# Altium schematic sheet 04-multimodal-flash.SchDoc
size A4; SheetNumber: 2; SheetTotal: 11
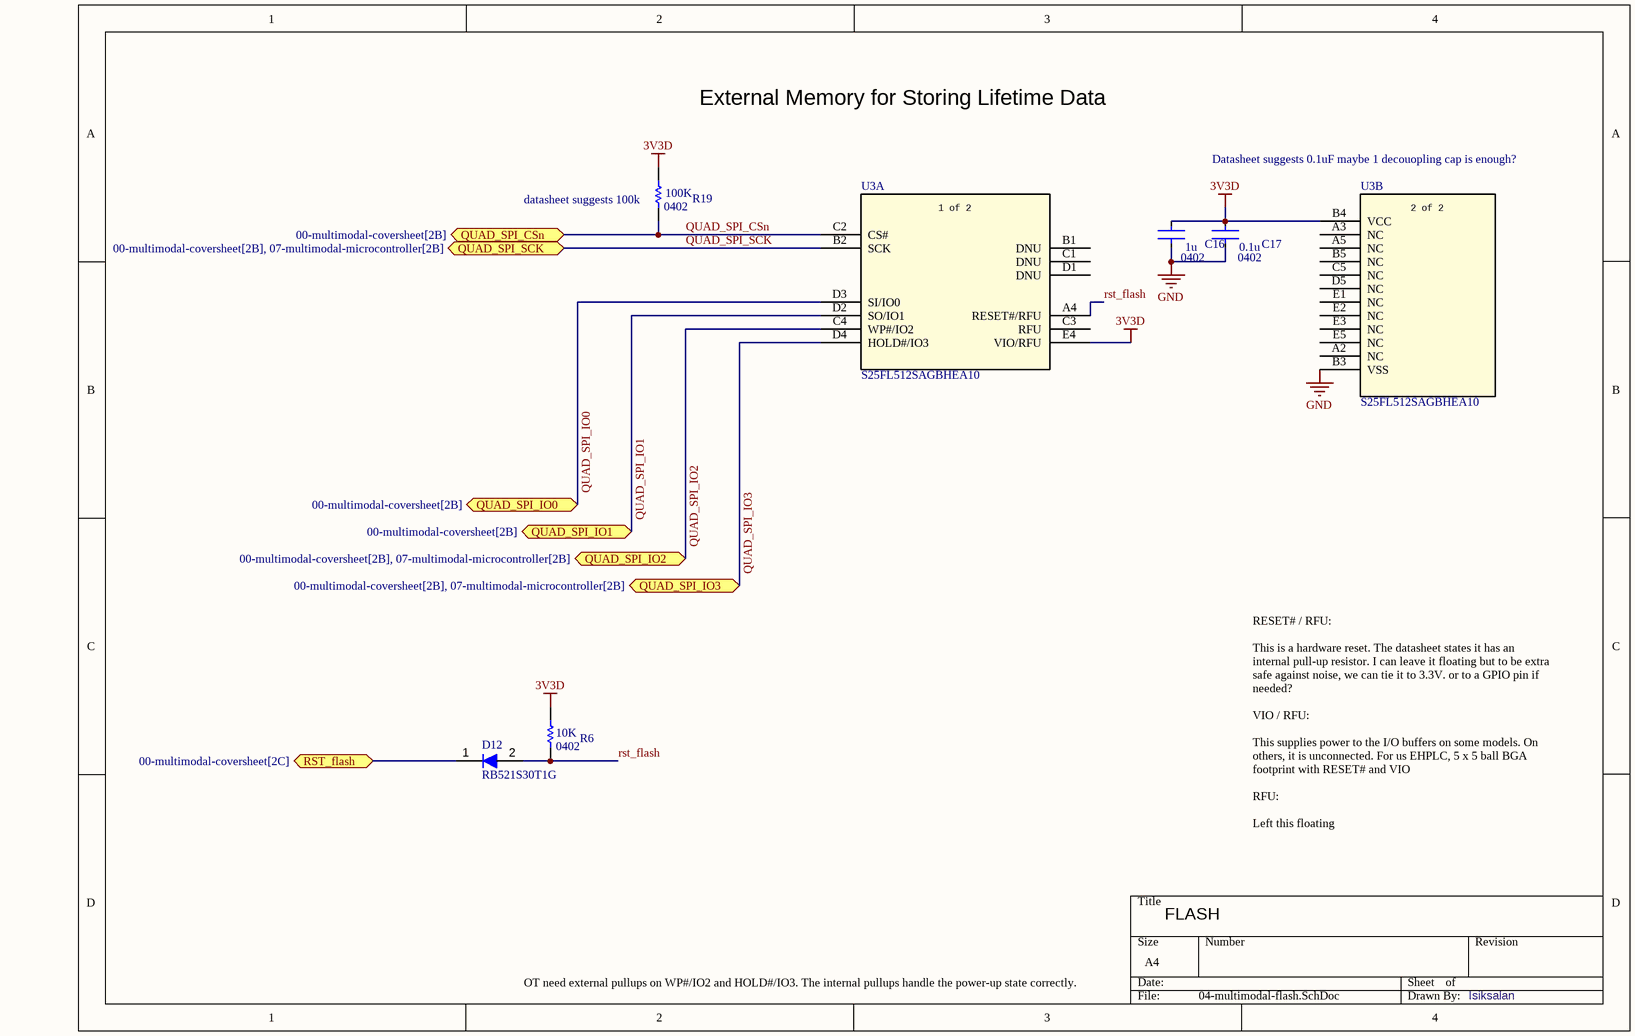
[diagram p0: 04-multimodal-flash.SchDoc]

## Parts
C16  C1005X5R1V105K050BC  [CAPTDK0402]  (value not drawn)
C17  C1005X7R1H104K050BB  [CAPTDK0402]  (value not drawn)
D12  RB521S30T1G  [SOD-523_0P9X1P3_ONS-L]
R6  RMCF0402FT10K0  [RES-STACK-POLE-0402]  (value not drawn)
R19  RMCF0402FT100K  [RES-STACK-POLE-0402]  (value not drawn)
U3  S25FL512SAGBHEA10  [BGA5x5_S25FL512SAGBHEA10_INF]  (parts A,B of 2)

## Ports
QUAD_SPI_CSn (bidir, see 00-multimodal-coversheet[2B]), QUAD_SPI_IO0 (bidir, see 00-multimodal-coversheet[2B]), QUAD_SPI_IO1 (bidir, see 00-multimodal-coversheet[2B]), QUAD_SPI_IO2 (bidir, see 00-multimodal-coversheet[2B], 07-multimodal-microcontroller[2B]), QUAD_SPI_IO3 (bidir, see 00-multimodal-coversheet[2B], 07-multimodal-microcontroller[2B]), QUAD_SPI_SCK (bidir, see 00-multimodal-coversheet[2B], 07-multimodal-microcontroller[2B]), RST_flash (bidir, see 00-multimodal-coversheet[2C])

## Nets
3V3D: C16.1 C17.1 R6.2 R19.2 U3.B4(VCC) U3.E4(VIO/RFU)
GND: C16.2 C17.2 U3.B3(VSS)
QUAD_SPI_CSn: R19.1 U3.C2(CS#) ; port QUAD_SPI_CSn
QUAD_SPI_IO0: U3.D3(SI/IO0) ; port QUAD_SPI_IO0
QUAD_SPI_IO1: U3.D2(SO/IO1) ; port QUAD_SPI_IO1
QUAD_SPI_IO2: U3.C4(WP#/IO2) ; port QUAD_SPI_IO2
QUAD_SPI_IO3: U3.D4(HOLD#/IO3) ; port QUAD_SPI_IO3
QUAD_SPI_SCK: U3.B2(SCK) ; port QUAD_SPI_SCK
rst_flash: D12.2 R6.1 U3.A4(RESET#/RFU)
RST_flash: D12.1 ; port RST_flash  [a separate net that carries the same name]

Not connected (* = marked no-connect by the designer): U3 A2(NC) A3(NC) A5(NC) B1(DNU) B5(NC) C1(DNU) C3(RFU) C5(NC) D1(DNU) D5(NC) E1(NC) E2(NC) E3(NC) E5(NC)

## Notes on the sheet
- External Memory for Storing Lifetime Data
- Datasheet suggests 0.1uF maybe 1 decouopling cap is enough?
- (near R19) datasheet suggests 100k
- RESET# / RFU:
  This is a hardware reset. The datasheet states it has an internal pull-up resistor. I can leave it floating but to be extra safe against noise, we can tie it to 3.3V. or to a GPIO pin if needed?
  VIO / RFU:
  This supplies power to the I/O buffers on some models. On others, it is unconnected. For us EHPLC, 5 x 5 ball BGA footprint with RESET# and VIO
  RFU:
  Left this floating
- FLASH
- OT need external pullups on WP#/IO2 and HOLD#/IO3. The internal pullups handle the power-up state correctly.
- Isiksalan
- (in symbol C1005X5R1V105K050BC) 1u; 0402
- (in symbol C1005X7R1H104K050BB) 0.1u; 0402
- (in symbol RMCF0402FT10K0) 10K; 0402
- (in symbol RMCF0402FT100K) 100K; 0402
- (in symbol S25FL512SAGBHEA10, part A) 1 of 2
- (in symbol S25FL512SAGBHEA10, part B) 2 of 2

## Library data of the parts
C16 = C1005X5R1V105K050BC: CAP CER 1UF 35V X5R 0402; Supplier 1: Digi-Key; Supplier Part Number 1: 445-9073-1-ND
C17 = C1005X7R1H104K050BB: CAP CER 0.1UF 50V X7R 0402; Supplier 1: Digi-Key; Supplier Part Number 1: 445-5932-1-ND
D12 = RB521S30T1G: DIODE SCHOTTKY 30V 200MA SOD523; Manufacturer: Hamamatsu; Manufacturer Part Number: S15193; ComponentLink1Description: Datasheet; ComponentLink1URL: https://www.hamamatsu.com/resources/pdf/ssd/s13773_kpin1088e.pdf; Supplier 1: Hamamatsu; Supplier 1 Part Number: S15193
R6 = RMCF0402FT10K0: RES 10K OHM 1% 1/16W 0402; Supplier 1: Digi-Key; Supplier Part Number 1: RMCF0402FT10K0CT-ND
R19 = RMCF0402FT100K: RES 100K OHM 1% 1/16W 0402; Supplier 1: Digi-Key; Supplier Part Number 1: RMCF0402FT100KCT-ND
U3 = S25FL512SAGBHEA10: FLASH - NOR Memory IC 512Mbit SPI - Quad I/O 133 MHz 24-BGA (6x8); Manufacturer_Name: Infineon; Type: Memory; Copyright: Copyright (C) 2025 Ultra Librarian. All rights reserved.; Manufacturer_Part_Number: S25FL512SAGBHEA10; RefDes: RefDes